# Altium schematic sheet HBridge.SchDoc
size A4; SheetNumber: 8; SheetTotal: 13
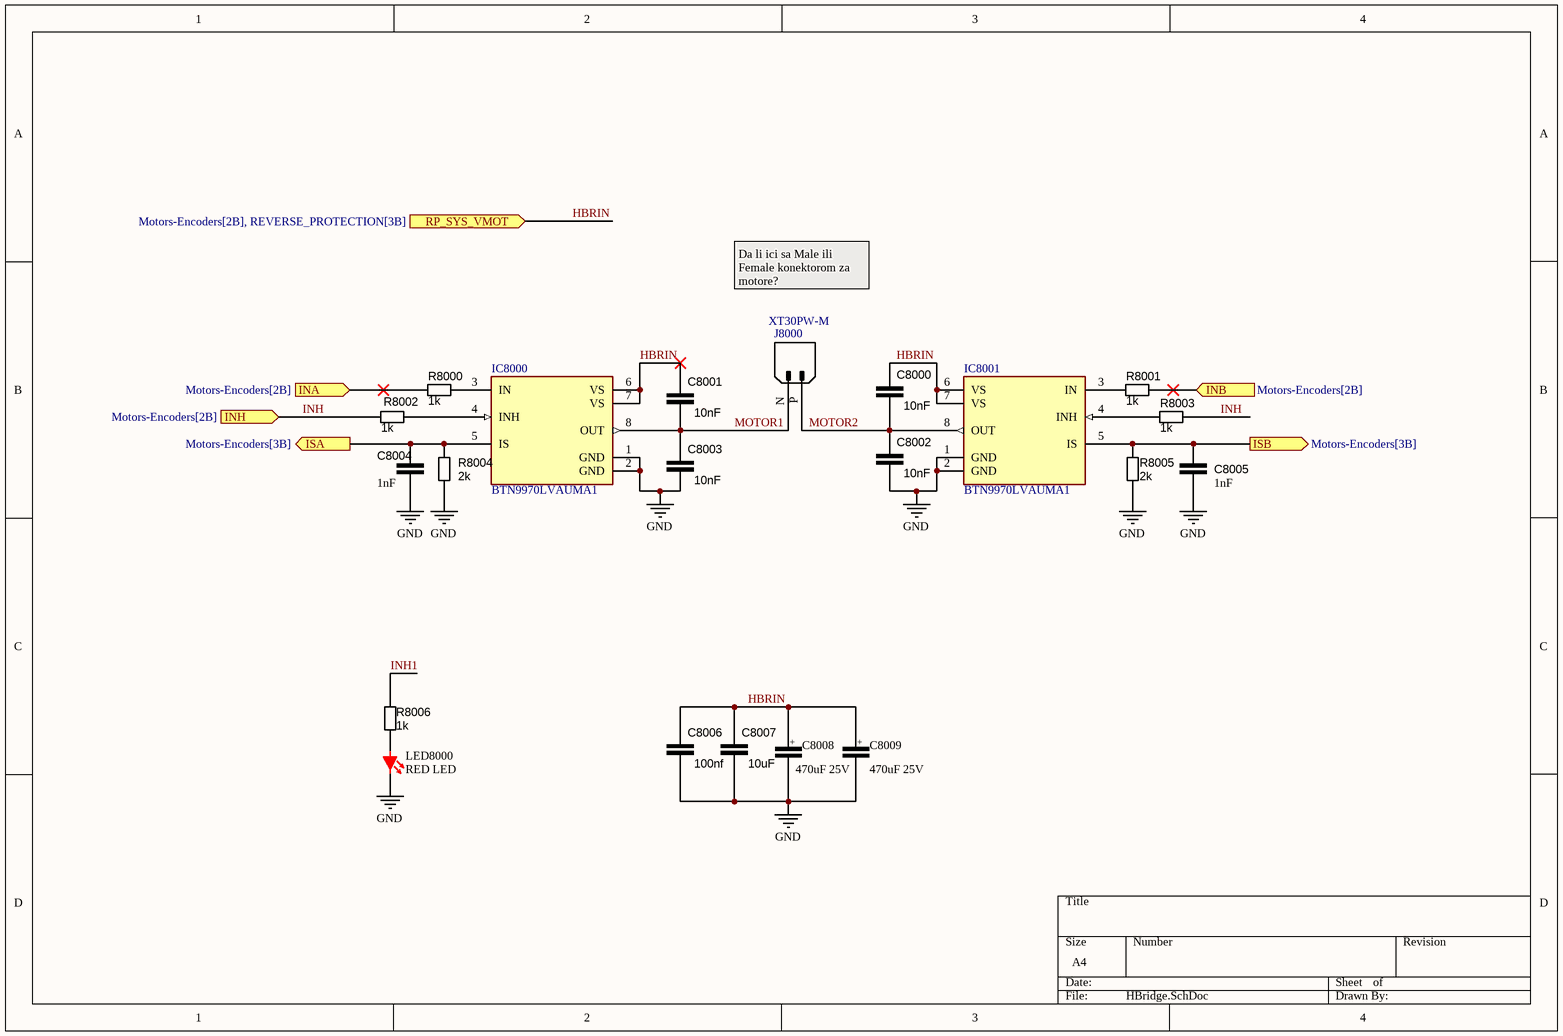
[diagram p0: HBridge.SchDoc]

## Parts
C8000  10nF  [CAP_0603]
C8001  10nF  [CAP_0603]
C8002  10nF  [CAP_0603]
C8003  10nF  [CAP_0603]
C8004  1nF  [CAP_0603]
C8005  1nF  [CAP_0603]
C8006  100nf  [CAP_0603]
C8007  10uF  [CAP_0603]
C8008  470uF 25V  [WCAP-ATG5_8X11.5(DXL)]
C8009  470uF 25V  [WCAP-ATG5_8X11.5(DXL)]
IC8000  BTN9970LVAUMA1  [FP-PG-HSOF-7-MFG]
IC8001  BTN9970LVAUMA1  [FP-PG-HSOF-7-MFG]
J8000  XT30PW-M  [AMASS_XT30PW-M]
LED8000  RED LED  [DIOC1608X04N]
R8000  1k  [RES_0603]
R8001  1k  [RES_0603]
R8002  1k  [RES_0603]
R8003  1k  [RES_0603]
R8004  2k  [RES_0603]
R8005  2k  [RES_0603]
R8006  1k  [RES_0603]

## Ports
INA (in, see Motors-Encoders[2B]), INB (in, see Motors-Encoders[2B]), INH (in, see Motors-Encoders[2B]), ISA (out, see Motors-Encoders[3B]), ISB (out, see Motors-Encoders[3B]), RP_SYS_VMOT (in, see Motors-Encoders[2B], REVERSE_PROTECTION[3B])

## Nets
GND: C8002.1 C8003.1 C8004.1 C8005.1 C8006.1 C8007.1 C8008.2(NEG) C8009.2(NEG) IC8000.1(GND) IC8000.2(GND) IC8001.1(GND) IC8001.2(GND) LED8000.2 R8004.2 R8005.2
HBRIN: C8000.2 C8001.2 C8006.2 C8007.2 C8008.1(POS) C8009.1(POS) IC8000.6(VS) IC8000.7(VS) IC8001.6(VS) IC8001.7(VS) ; port RP_SYS_VMOT
INA: R8000.2 ; port INA
INB: R8001.2 ; port INB
INH: R8002.2 R8003.2 ; port INH
INH1: R8006.1
ISA: C8004.2 IC8000.5(IS) R8004.1 ; port ISA
ISB: C8005.2 IC8001.5(IS) R8005.1 ; port ISB
MOTOR1: C8001.1 C8003.2 IC8000.8(OUT) J8000.N
MOTOR2: C8000.1 C8002.2 IC8001.8(OUT) J8000.P
NetIC8000_3: IC8000.3(IN) R8000.1
NetIC8000_4: IC8000.4(INH) R8002.1
NetIC8001_3: IC8001.3(IN) R8001.1
NetIC8001_4: IC8001.4(INH) R8003.1
NetLED8000_1: LED8000.1 R8006.2

## Notes on the sheet
- Da li ici sa Male ili Female konektorom za motore?
- (in symbol WCAP-ATG5_8X11.5) +

## Library data of the parts
C8000-C8003 C8006 C8007 = C000007: CAP CER 100nF 0603 25V X7R; capaticanse: 100nf; ComponentLink1Description: digikey; ComponentLink1URL: https://www.digikey.com/en/products/detail/kyocera-avx/06033C104K4T2A/8019250
C8004 C8005 = C000021: 82 pF ±1% 25V Ceramic Capacitor C0G, NP0 0603 (1608 Metric); capacitance: 82pF; ComponentLink1Description: DigiKey; ComponentLink1URL: https://www.digikey.com/en/products/detail/kyocera-avx/KGM15ACG1E820FT/1599315?s=N4IgjCBcoMxaBjKAzAhgGwM4FMA0IB7KAbXDBggF18AHAFyhAGU6AnASwDsBzEAX3xgALPBBJIaLHkIlwAVgCcAJiEB2ENRD1GLDj36CAbKPGSc%2BIpFIxlQ45u2RmbLrwEglABiEKTKDOYyViAAHEoABDQAYhq0DE4AqpzsdADyyACy2KiYAK6s2AYgALRKfpBsudKWpHIafA1AA; DigiKey Part Number: 478-KGM15ACG1E820FTCT-ND
C8008 C8009 = WCAP-ATG5_8X11.5: <b>WCAP-ATG5 Aluminium Electrolytic Capacitors </B><BR><BR> <B>General Purpose +105 Â°C </B><BR><BR> <B>Characteristics</B><BR> <BR>General purpose product series with max. operating temperature of +105 Â°C  <BR>Mounting style: THT Radial  <BR>Capacitance range: 0.1 ÂµF â€’ 18000 ÂµF  <BR>Capacitance tolerance: Â±20 %  <BR>Operating temperature:  <BR>-40 Â°C up to +105 Â°C for UR < 400 V(DC)  <BR>-25 Â°C up to +105 Â°C for UR â‰¥ 400 V(DC)  <BR>Endurance: 2000 h @ +105 Â°C  <BR>Dimensions (DxL) in mm: 5.0 x 11.0 up to 22.0 x 31.0  <BR>Recommended soldering: Wave soldering  <BR> <BR> <B>Applications</B><BR> <BR>Filtering  <BR>Smoothing  <BR>Energy storage  <BR>Coupling  e.g. Switched-mode power supply, AC/DC converter, adapter, charger, digital camera  <BR> <BR><BR> <BR> <br><a href="https://www.we-online.com/catalog/media/o683503v209%20family-wcap-atg5-860020672004.jpg" title="Enlarge picture"> <img src="https://www.we-online.com/catalog/media/o683503v209%20family-wcap-atg5-860020672004.jpg"  width="320"></a><p> </b><br>             Details see: <a href="www.we-online.com/catalog/WCAP-ATG5/?utm_source=eagle_model&utm_medium=description_link&utm_campaign=eisos_eagle">www.we-online.com/catalog/WCAP-ATG5</a><p> Updated by yingchun,Shan;2020-02-28 <br>2020(C) WÃ¼rth Elektronik; MF: {'manufacturer': u'W\xfcrth Elektronik'}; MP: 860020474014; Package: None; Price: None; Value: *; Availability: Unavailable
IC8000 IC8001 = CMP-32854-000022-1: DC_MOTOR_CONTROL PG-HSOF-7
J8000 = XT30PW-M: MF: {'manufacturer': u'AMASS'}; Package: None; Price: None; Value: *; MP: XT30PW-M; Availability: Unavailable
LED8000 = 00000008: LED RED DIFFUSED 0603 SMD; Supplier 1: Avnet; Supplier Part Number 1: Q65111A3964; ComponentLink1Description: Digikey; ComponentLink1URL: https://www.digikey.com/en/products/detail/ams-osram-usa-inc/LG-Q396-PS-35/5249855
R8000-R8006 = R000004: RES 150 OHM 1% 1/10W 0603; resistance: 1Kohm; ComponentLink1Description: digikey; ComponentLink1URL: https://www.digikey.com/en/products/detail/vishay-beyschlag-draloric-bc-components/MCT06030C1001FP500/2607821